# EAGLE schematic Schematics (EAGLE 9.1.0)
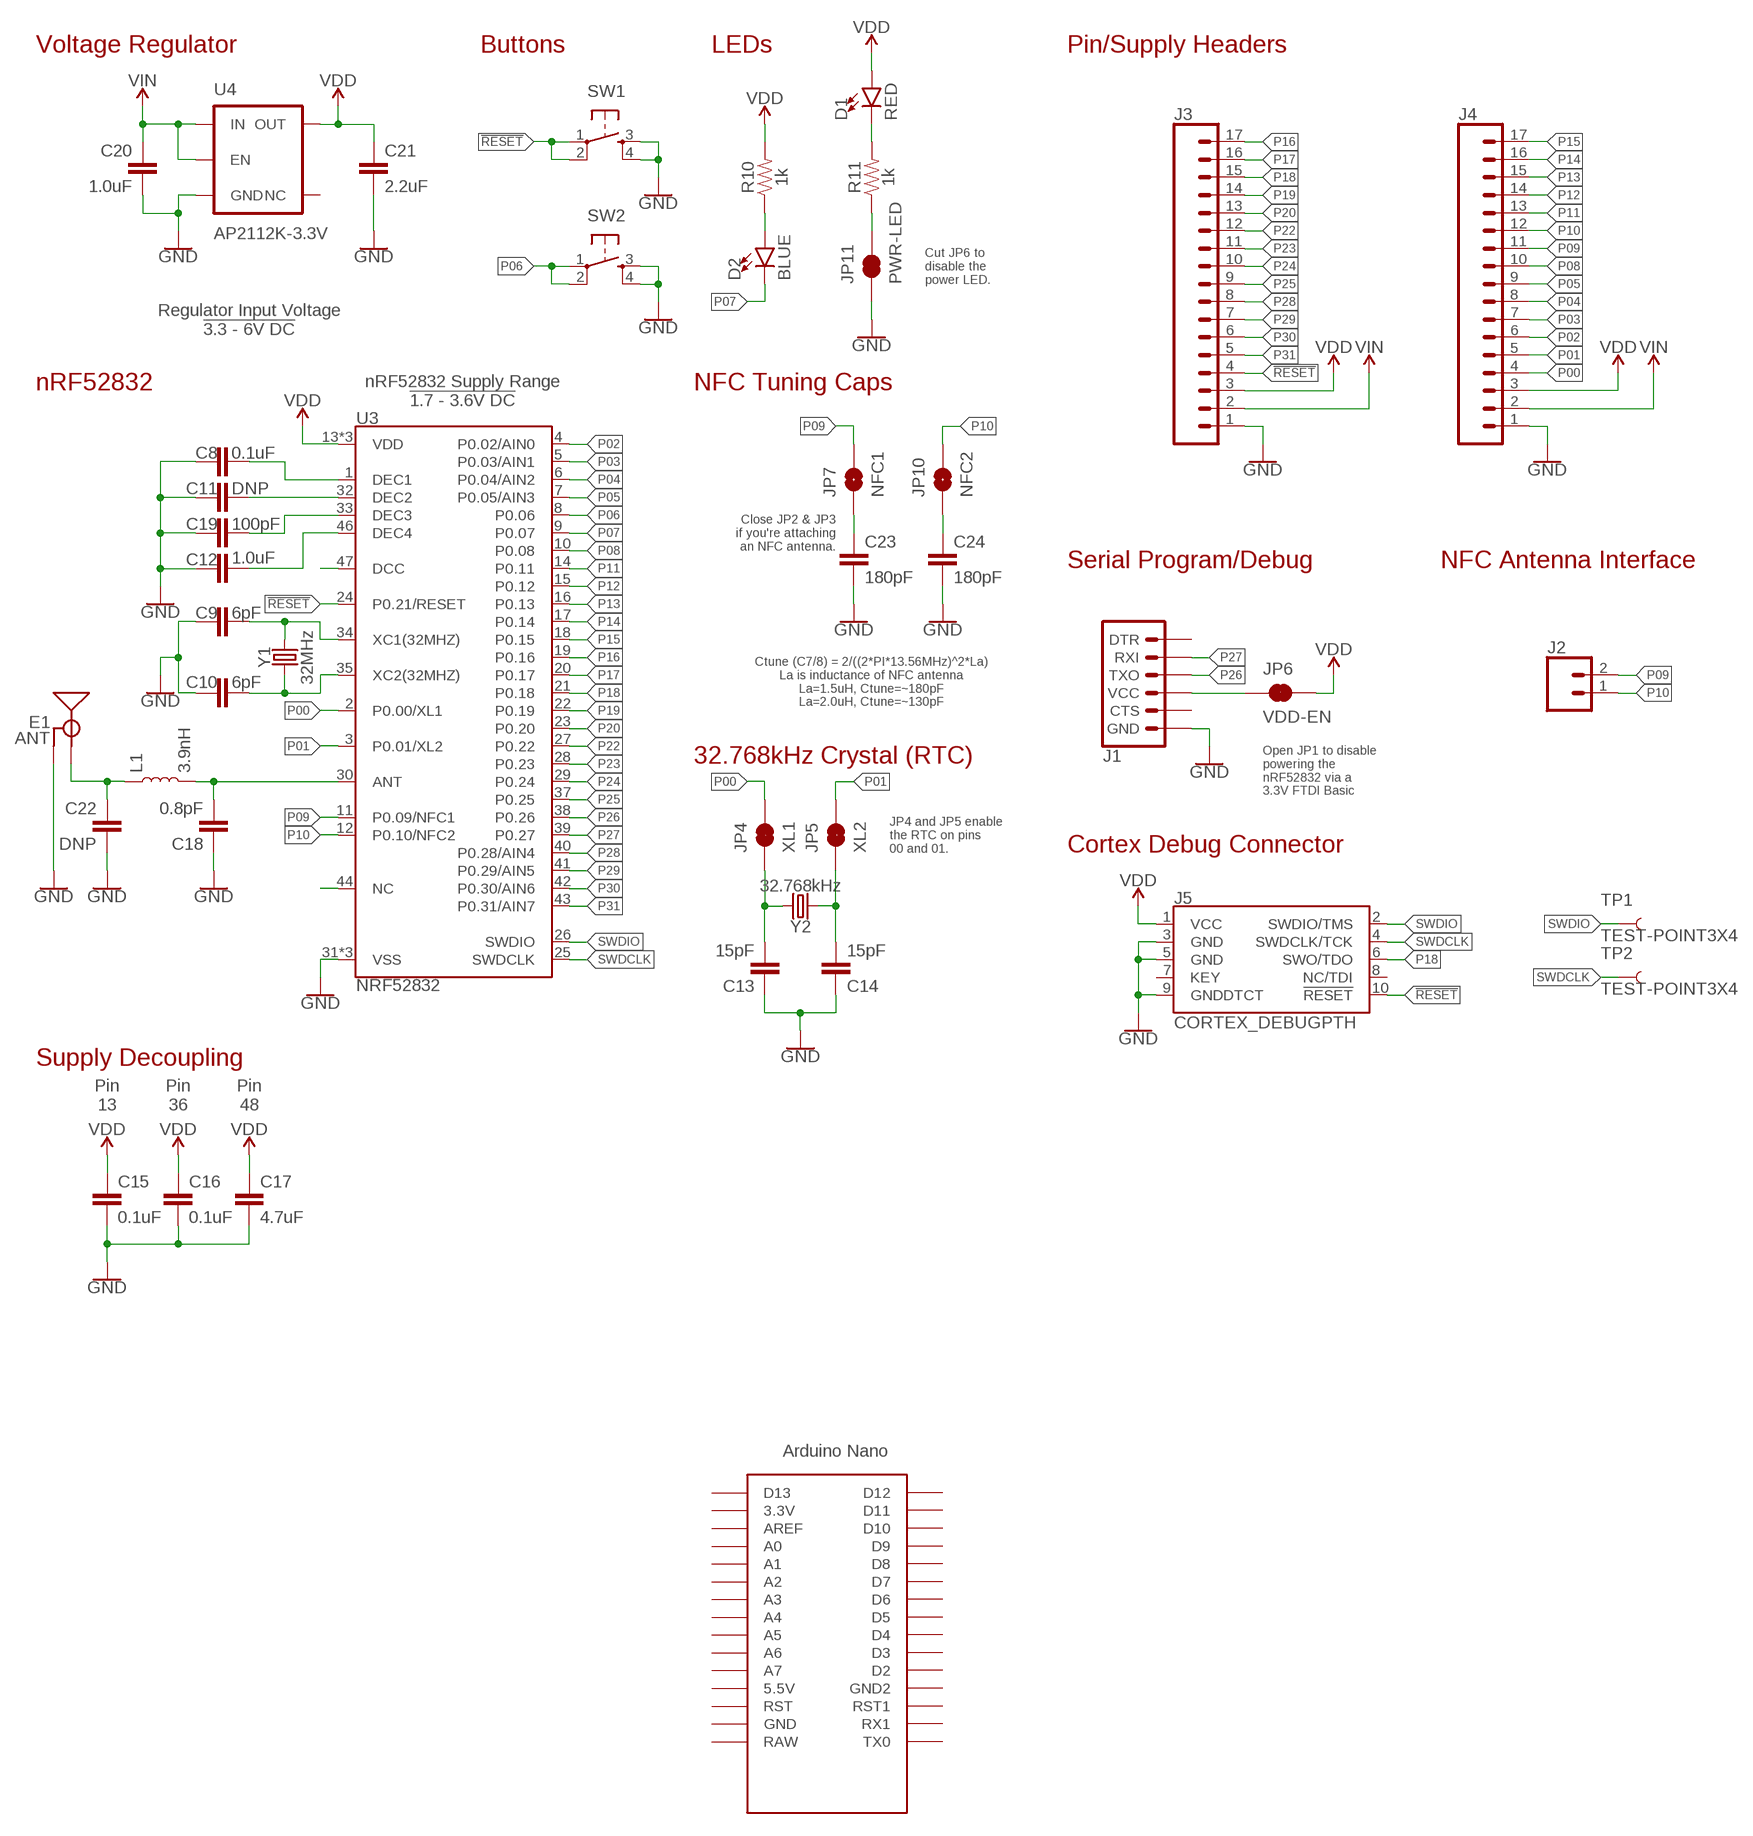
[diagram p0: schematic, sheet 1, part 1 of 2]
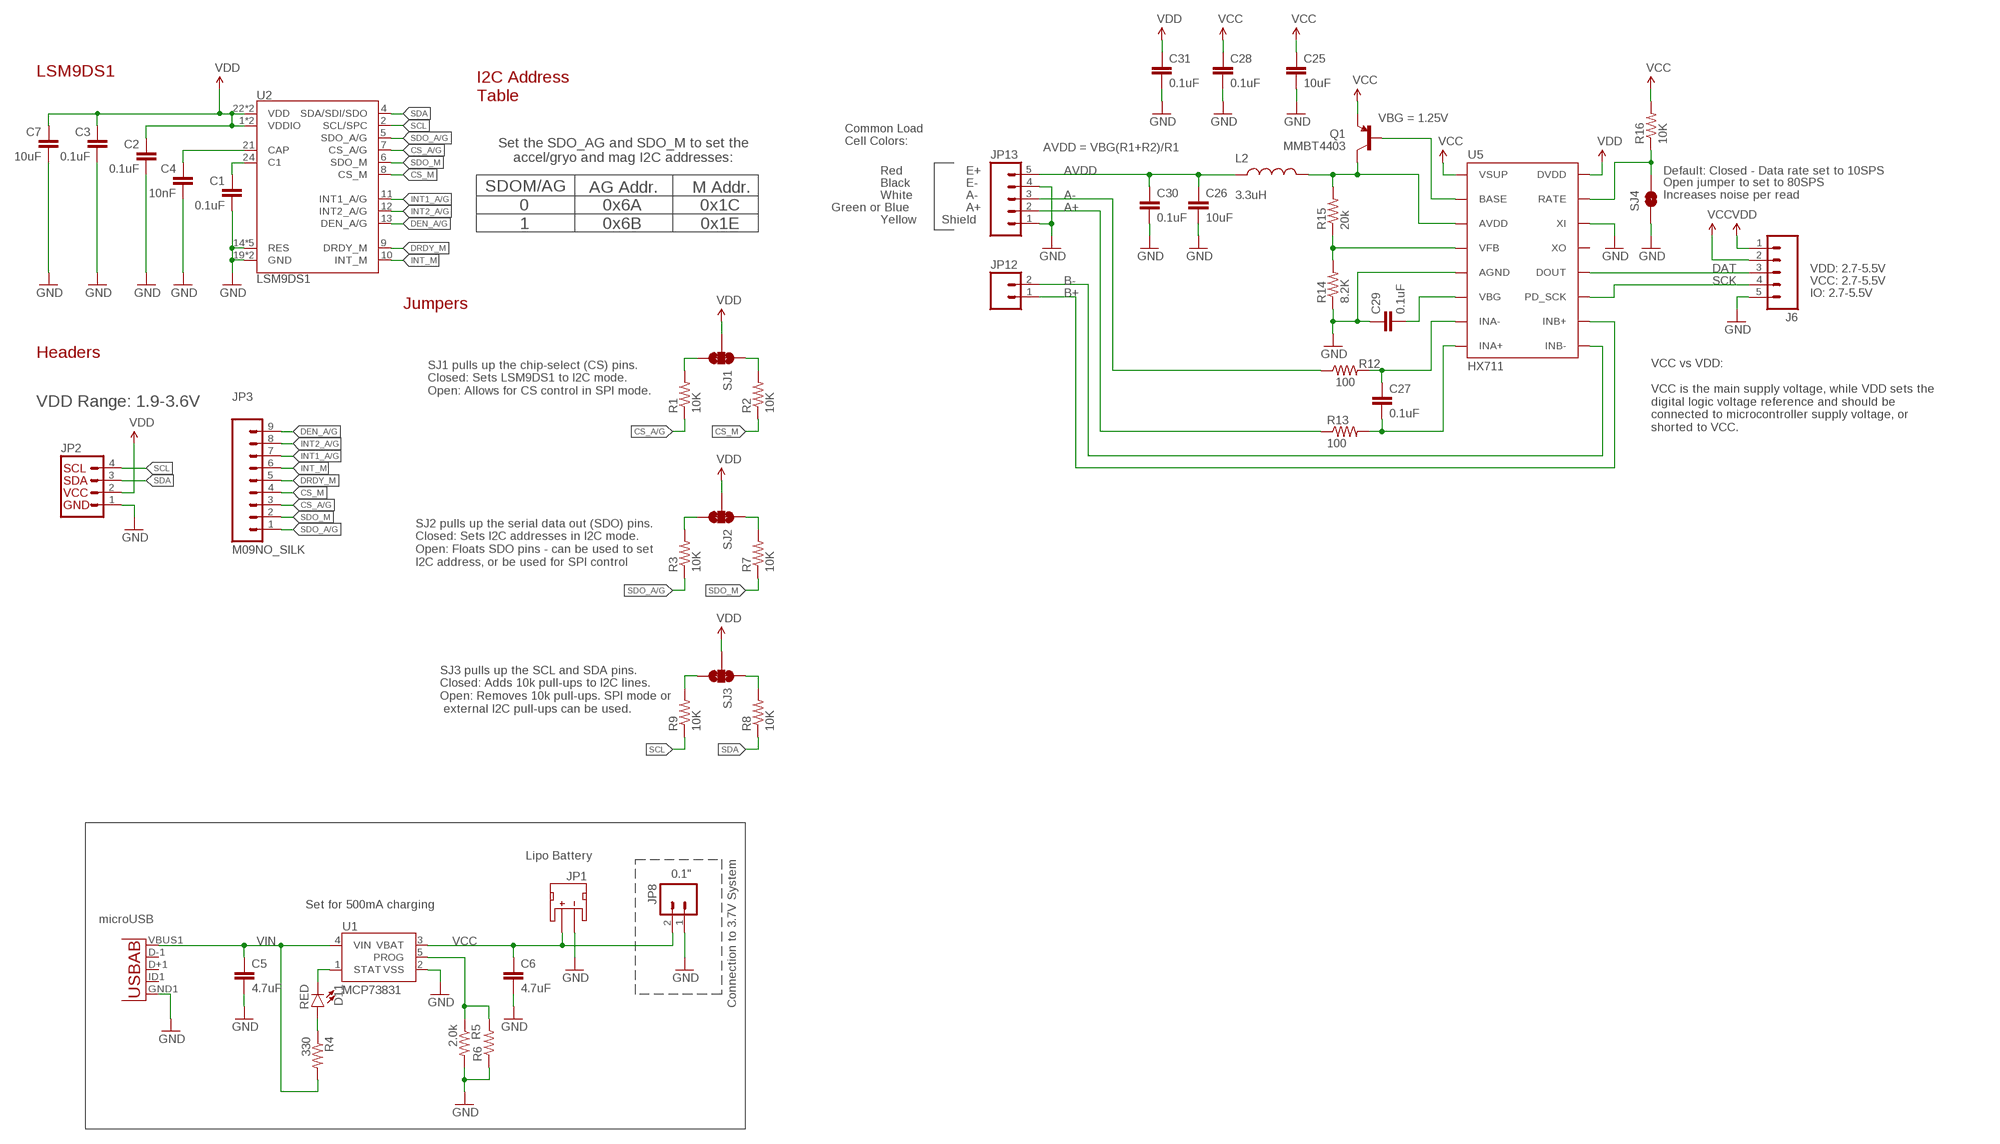
[diagram p1: schematic, sheet 1, part 2 of 2]

## Parts
C1  0.1uF  0.1UF-25V(+80/-20%)(0603)  [0603-CAP@1]
C2  0.1uF  0.1UF-25V(+80/-20%)(0603)  [0603-CAP@1]
C3  0.1uF  0.1UF-25V(+80/-20%)(0603)  [0603-CAP@1]
C4  10nF  10NF/10000PF-50V-10%(0603)  [0603-CAP@1]
C5  4.7uF  4.7UF-6.3V-10%(0603)0603  [0603-CAP@1]
C6  4.7uF  4.7UF-6.3V-10%(0603)0603  [0603-CAP@1]
C7  10uF  10UF-6.3V-20%(0603)  [0603-CAP@1]
C8  0.1uF  0.1UF-0402-16V-10%  [0402]
C9  6pF  6PF-0402-50V-0.5%  [0402]
C10  6pF  6PF-0402-50V-0.5%  [0402]
C11  DNP  CAP0402  [0402]
C12  1.0uF  1.0UF-0402-16V-10%  [0402]
C13  15pF  15PF-0402-50V-5%  [0402]
C14  15pF  15PF-0402-50V-5%  [0402]
C15  0.1uF  0.1UF-0402-16V-10%  [0402]
C16  0.1uF  0.1UF-0402-16V-10%  [0402]
C17  4.7uF  4.7UF0603  [0603]
C18  0.8pF  0.8PF-0402-50V-0.1PF  [0402]
C19  100pF  100PF-0402-50V-5%  [0402]
C20  1.0uF  1.0UF-0603-16V-10%  [0603]
C21  2.2uF  2.2UF-0603-10V-20%  [0603]
C22  DNP  CAP0402  [0402]
C23  180pF  180PF-0603-50V-5%  [0603]
C24  180pF  180PF-0603-50V-5%  [0603]
C25  10uF  10UF50V20%(1210)  [1210]
C26  10uF  10UF50V20%(1210)  [1210]
C27  0.1uF  0.1UF-25V-5%(0603)  [0603-CAP]
C28  0.1uF  0.1UF-25V-5%(0603)  [0603-CAP]
C29  0.1uF  0.1UF-25V-5%(0603)  [0603-CAP]
C30  0.1uF  0.1UF-25V-5%(0603)  [0603-CAP]
C31  0.1uF  0.1UF-25V-5%(0603)  [0603-CAP]
D1  RED  LED-RED0603  [LED-0603]
D2  BLUE  LED-BLUE0603  [LED-0603]
D11  RED  LED-RED0603  [LED-0603]
E1  ANT  ANTENNA-GROUNDEDTRACE-15.2MM  [TRACE_ANTENNA_2.4GHZ_15.2MM]
J1  ARDUINO_SERIAL_PROGRAMPTH  [1X06]
J2  CONN_02PTH  [1X02@2]
J3  CONN_17  [1X17]
J4  CONN_17  [1X17]
J5  CORTEX_DEBUGPTH  [2X5-PTH-1.27MM]
J6  M05PTH  [1X05]
JP1  JST  JST_2MM_MALE  [JST-2-SMD@1]
JP2  I2C_STANDARD_NO_SILK  [1X04_NO_SILK]
JP3  M09NO_SILK  [1X09_NO_SILK]
JP4  XL1  JUMPER-PAD-2-NC_BY_TRACE  [PAD-JUMPER-2-NC_BY_TRACE_YES_SILK]
JP5  XL2  JUMPER-PAD-2-NC_BY_TRACE  [PAD-JUMPER-2-NC_BY_TRACE_YES_SILK]
JP6  VDD-EN  JUMPER-SMT_2_NC_TRACE_SILK  [SMT-JUMPER_2_NC_TRACE_SILK]
JP7  NFC1  JUMPER-SMT_2_NO_SILK  [SMT-JUMPER_2_NO_SILK]
JP8  M02PTH  [1X02]
JP9  Micro USB  USB-ABCONN-11794  [USB-AB-MICRO-SMD_V03]
JP10  NFC2  JUMPER-SMT_2_NO_SILK  [SMT-JUMPER_2_NO_SILK]
JP11  PWR-LED  JUMPER-PAD-2-NC_BY_TRACE  [PAD-JUMPER-2-NC_BY_TRACE_YES_SILK]
JP12  M02PTH  [1X02]
JP13  M05PTH  [1X05]
L1  3.9nH  INDUCTOR-0402-3.9NH  [0402]
L2  3.3uH  INDUCTOR0805-IND  [0805]
Q1  MMBT4403  TRANSISTOR_PNPMMBT4403  [SOT23-3]
R1  10K  10KOHM-1/10W-1%(0603)0603  [0603-RES]
R2  10K  10KOHM-1/10W-1%(0603)0603  [0603-RES]
R3  10K  10KOHM-1/10W-1%(0603)0603  [0603-RES]
R4  330  330OHM1/10W1%(0603)  [0603-RES@1]
R5  2.0k  2.0KOHM1/10W5%(0603)  [0603-RES@1]
R6  RESISTORPTH-1/4W-VERT-KIT  [AXIAL-0.1EZ]
R7  10K  10KOHM-1/10W-1%(0603)0603  [0603-RES]
R8  10K  10KOHM-1/10W-1%(0603)0603  [0603-RES]
R9  10K  10KOHM-1/10W-1%(0603)0603  [0603-RES]
R10  1k  1KOHM-0603-1/10W-1%  [0603]
R11  1k  1KOHM-0603-1/10W-1%  [0603]
R12  100  100OHM-1/10W-1%(0603)  [0603-RES]
R13  100  100OHM-1/10W-1%(0603)  [0603-RES]
R14  8.2K  8.2KOHM-1/10W-5%(0603)  [0603-RES]
R15  20k  20KOHM1/10W1%(0603)  [0603-RES]
R16  10K  10KOHM-1/10W-1%(0603)0603  [0603-RES]
SJ1  JUMPER-PAD-3-NC_BY_TRACE  [PAD-JUMPER-3-3OF3_NC_BY_TRACE_YES_SILK_FULL_BOX]
SJ2  JUMPER-PAD-3-NC_BY_TRACE  [PAD-JUMPER-3-3OF3_NC_BY_TRACE_YES_SILK_FULL_BOX]
SJ3  JUMPER-PAD-3-NC_BY_TRACE  [PAD-JUMPER-3-3OF3_NC_BY_TRACE_YES_SILK_FULL_BOX]
SJ4  JUMPER-PAD-2-NC_BY_TRACE  [PAD-JUMPER-2-NC_BY_TRACE_YES_SILK]
SW1  SWITCH_SPST_4_PINRECT  [TACTILE_SWITCH_SMD_4.6X2.8MM]
SW2  SWITCH_SPST_4_PINRECT  [TACTILE_SWITCH_SMD_4.6X2.8MM]
TP1  TEST-POINT3X4  [PAD.03X.04]
TP2  TEST-POINT3X4  [PAD.03X.04]
U1  MCP73831  [SOT23-5@1]
U2  LSM9DS1  [LGA24-8X4]
U3  NRF52832  [QFN48-6X6MM]
U4  AP2112K-3.3V  V_REG_AP2112K-3.3V  [SOT23-5]
U5  HX711  HX711HX711  [SO16]
U$1  NANO  [NANO]
Y1  32MHz  CRYSTAL-32MHZ-SMD-2.0X1.6MM  [CRYSTAL-SMD-2.0X1.6MM]
Y2  32.768kHz  CRYSTAL-32.768KHZSMD-3.2X1.5  [CRYSTAL-SMD-3.2X1.5MM]

## Nets
!RESET!: J3.4 J5.10(!RESET) SW1.1 SW1.2 U3.24(P0.21/RESET)
A+: JP13.2 R13.1
A-: JP13.3 R12.1
ANT: C18.2 L1.2 U3.30(ANT)
AVDD: C26.1 C30.1 JP13.5 L2.1
B+: JP12.1 U5.10(INB+)
B-: JP12.2 U5.9(INB-)
C1: C1.1 U2.24(C1)
CAP: C4.1 U2.21(CAP)
CS_A/G: JP3.3 R1.1 U2.7(CS_A/G)
CS_A/G_PU: R1.2 SJ1.3
CS_M: JP3.4 R2.1 U2.8(CS_M)
CS_M_PU: R2.2 SJ1.1
DAT: J6.3 U5.12(DOUT)
DCC: U3.47(DCC)
DEC1: C8.2 U3.1(DEC1)
DEC2: C11.2 U3.32(DEC2)
DEC3: C19.2 U3.33(DEC3)
DEC4: C12.2 U3.46(DEC4)
DEN_A/G: JP3.9 U2.13(DEN_A/G)
DRDY_M: JP3.5 U2.9(DRDY_M)
GND: C1.2 C2.2 C3.2 C4.2 C5.2 C6.2 C7.2 C8.1 C9.1 C10.2 C11.1 C12.1 C13.1 C14.1 C15.2 C16.2 C17.2 C18.1 C19.1 C20.2 C21.2 C22.2 C23.2 C24.2 C25.2 C26.2 C28.2 C29.1 C30.2 C31.2 E1.GND J1.6(GND) J3.1 J4.1 J5.3(GND) J5.5(GND) J5.9(GNDDTCT) J6.5 JP1.1(-) JP2.1 JP8.1 JP9.GND1(GND) JP11.1 JP13.1 JP13.4 R5.2 R6.P$1 R14.1 SJ4.1 SW1.3 SW1.4 SW2.3 SW2.4 U1.2(VSS) U2.14(RES) U2.15(RES) U2.16(RES) U2.17(RES) U2.18(RES) U2.19(GND) U2.20(GND) U3.31(VSS) U3.45(VSS) U3.EP(VSS) U4.2(GND) U5.5(AGND) U5.14(XI)
INT1_A/G: JP3.7 U2.11(INT1_A/G)
INT2_A/G: JP3.8 U2.12(INT2_A/G)
INT_M: JP3.6 U2.10(INT_M)
N$1: JP11.2 R11.1
N$2: Q1.1(B) U5.2(BASE)
N$3: C13.2 JP4.1 Y2.P$2
N$4: C14.2 JP5.1 Y2.P$1
N$5: L2.2 Q1.3(C) R15.2 U5.3(AVDD)
N$6: R14.2 R15.1 U5.4(VFB)
N$7: C29.2 U5.6(VBG)
N$8: D11.A R4.1
N$9: R16.1 SJ4.2 U5.15(RATE)
N$10: C27.1 R12.2 U5.7(INA-)
N$11: C22.1 E1.ANT(SIGNAL) L1.1
N$12: D1.C R11.2
N$13: C27.2 R13.2 U5.8(INA+)
N$14: J1.4(VCC) JP6.1
N$15: D2.A R10.1
NC: U3.44(NC)
NFC1: C23.1 JP7.1
NFC2: C24.1 JP10.1
P00: J4.4 JP4.2 U3.2(P0.00/XL1)
P01: J4.5 JP5.2 U3.3(P0.01/XL2)
P02: J4.6 U3.4(P0.02/AIN0)
P03: J4.7 U3.5(P0.03/AIN1)
P04: J4.8 U3.6(P0.04/AIN2)
P05: J4.9 U3.7(P0.05/AIN3)
P06: SW2.1 SW2.2 U3.8(P0.06)
P07: D2.C U3.9(P0.07)
P08: J4.10 U3.10(P0.08)
P09: J2.2 J4.11 JP7.2 U3.11(P0.09/NFC1)
P10: J2.1 J4.12 JP10.2 U3.12(P0.10/NFC2)
P11: J4.13 U3.14(P0.11)
P12: J4.14 U3.15(P0.12)
P13: J4.15 U3.16(P0.13)
P14: J4.16 U3.17(P0.14)
P15: J4.17 U3.18(P0.15)
P16: J3.17 U3.19(P0.16)
P17: J3.16 U3.20(P0.17)
P18: J3.15 J5.6(SWO/TDO) U3.21(P0.18)
P19: J3.14 U3.22(P0.19)
P20: J3.13 U3.23(P0.20)
P22: J3.12 U3.27(P0.22)
P23: J3.11 U3.28(P0.23)
P24: J3.10 U3.29(P0.24)
P25: J3.9 U3.37(P0.25)
P26: J1.3(TXO) U3.38(P0.26)
P27: J1.2(RXI) U3.39(P0.27)
P28: J3.8 U3.40(P0.28/AIN4)
P29: J3.7 U3.41(P0.29/AIN5)
P30: J3.6 U3.42(P0.30/AIN6)
P31: J3.5 U3.43(P0.31/AIN7)
PROG: R5.1 R6.P$2 U1.5(PROG)
SCK: J6.4 U5.11(PD_SCK)
SCL: JP2.4 R9.1 U2.2(SCL/SPC)
SCL_PU: R9.2 SJ3.3
SDA: JP2.3 R8.1 U2.4(SDA/SDI/SDO)
SDA_PU: R8.2 SJ3.1
SDO_A/G: JP3.1 R3.1 U2.5(SDO_A/G)
SDO_A/G_PU: R3.2 SJ2.3
SDO_M: JP3.2 R7.1 U2.6(SDO_M)
SDO_M_PU: R7.2 SJ2.1
STAT: D11.C U1.1(STAT)
SWDCLK: J5.4(SWDCLK/TCK) TP2.P$1 U3.25(SWDCLK)
SWDIO: J5.2(SWDIO/TMS) TP1.P$1 U3.26(SWDIO)
VCC: C6.1 C25.1 C28.1 J6.2 JP1.2(+) JP8.2 Q1.2(E) R16.2 U1.3(VBAT) U5.1(VSUP)
VDD: C2.1 C3.1 C7.1 C15.1 C16.1 C17.1 C21.1 C31.1 D1.A J3.3 J4.3 J5.1(VCC) J6.1 JP2.2 JP6.2 R10.2 SJ1.2 SJ2.2 SJ3.2 U2.1(VDDIO) U2.3(VDDIO) U2.22(VDD) U2.23(VDD) U3.13(VDD) U3.36(VDD) U3.48(VDD) U4.5(OUT) U5.16(DVDD)
VIN: C5.1 C20.1 J3.2 J4.2 JP9.VBUS1(VBUS) R4.2 U1.4(VIN) U4.1(IN) U4.3(EN)
XC1: C9.2 U3.34(XC1(32MHZ)) Y1.3
XC2: C10.1 U3.35(XC2(32MHZ)) Y1.1
Unconnected: J1.1(DTR) J1.5(CTS) J5.7(KEY) J5.8(NC/TDI) JP1.NC1(PAD1) JP1.NC2(PAD2) JP9.D+1(D+) JP9.D-1(D-) JP9.ID1(USBID) U4.4(NC) U5.13(XO) U$1.3.3V U$1.5V(5.5V) U$1.A0 U$1.A1 U$1.A2 U$1.A3 U$1.A4 U$1.A5 U$1.A6 U$1.A7 U$1.AREF U$1.D2 U$1.D3 U$1.D4 U$1.D5 U$1.D6 U$1.D7 U$1.D8 U$1.D9 U$1.D10 U$1.D11 U$1.D12 U$1.D13 U$1.GND U$1.GND1(GND2) U$1.ICSP1 U$1.ICSP2 U$1.ICSP3 U$1.ICSP4 U$1.ICSP5 U$1.ICSP6 U$1.RAW U$1.RST U$1.RST1 U$1.RX1 U$1.TX0

## Notes on the sheet
- Voltage Regulator | Buttons | LEDs | Pin/Supply Headers
- LSM9DS1
- I2C Address
  Table
- VBG = 1.25V
- Common Load
  Cell Colors:
- Set the SDO_AG and SDO_M to set the
  accel/gryo and mag I2C addresses:
- AVDD = VBG(R1+R2)/R1
- Red | E+ | Default: Closed - Data rate set to 10SPS
- SDOM/AG | AG Addr. | M Addr. | Black | E-
- Cut JP6 to
  disable the
  power LED.
- White | A-
- Open jumper to set to 80SPS
  Increases noise per read
- Green or Blue | A+
- 0
  1
- 0x6A
  0x6B
- 0x1C
  0x1E
- Yellow | Shield
- Regulator Input Voltage
  !3.3 - 6V DC!
- VDD: 2.7-5.5V
- VCC: 2.7-5.5V
- nRF52832
- nRF52832 Supply Range
  !1.7 - 3.6V DC!
- NFC Tuning Caps | IO: 2.7-5.5V
- Jumpers
- Headers
- Close JP2 & JP3
  if you're attaching
  an NFC antenna.
- SJ1 pulls up the chip-select (CS) pins.
  Closed: Sets LSM9DS1 to I2C mode.
  Open: Allows for CS control in SPI mode.
- VDD Range: 1.9-3.6V
- Serial Program/Debug | NFC Antenna Interface
- VCC vs VDD:
  
  VCC is the main supply voltage, while VDD sets the
  digital logic voltage reference and should be
  connected to microcontroller supply voltage, or
  shorted to VCC.
- Ctune (C7/8) = 2/((2*PI*13.56MHz)^2*La)
  La is inductance of NFC antenna
  La=1.5uH, Ctune=~180pF
  La=2.0uH, Ctune=~130pF
- Open JP1 to disable 
  powering the 
  nRF52832 via a
  3.3V FTDI Basic
- 32.768kHz Crystal (RTC)
- SJ2 pulls up the serial data out (SDO) pins.
  Closed: Sets I2C addresses in I2C mode.
  Open: Floats SDO pins - can be used to set
  I2C address, or be used for SPI control
- JP4 and JP5 enable
  the RTC on pins
  00 and 01.
- Cortex Debug Connector
- SJ3 pulls up the SCL and SDA pins.
  Closed: Adds 10k pull-ups to I2C lines.
  Open: Removes 10k pull-ups. SPI mode or
   external I2C pull-ups can be used.
- Supply Decoupling
- Pin
  13
- Pin
  36
- Pin
  48
- Lipo Battery
- 0.1"
- Set for 500mA charging
- microUSB
- Connection to 3.7V System

## Library data of the parts
C1-C3 = SparkFun-Capacitors:0.1UF-25V(+80/-20%)(0603): CAP-00810 Ceramic Standard decoupling cap; PROD_ID: CAP-00810
C4 = SparkFun-Capacitors:10NF/10000PF-50V-10%(0603): CAP-00867; PROD_ID: CAP-00867
C5 C6 = SparkFun-Capacitors:4.7UF-6.3V-10%(0603): CAP-08280; PROD_ID: CAP-08280
C7 = SparkFun-Capacitors:10UF-6.3V-20%(0603): CAP-11015; PROD_ID: CAP-11015
C8 C15 C16 = SparkFun-Capacitors:0.1UF: 0.1µF ceramic capacitors A capacitor is a passive two-terminal electrical component used to store electrical energy temporarily in an electric field.; PROD_ID: CAP-12416
C9 C10 = nrf52832-breakout-temp:6PF: 15pF ceramic capacitors A capacitor is a passive two-terminal electrical component used to store electrical energy temporarily in an electric field.; PROD_ID: CAP-13455
C11 C22 = SparkFun-Passives:CAP: Capacitor Standard 0603 ceramic capacitor, and 0.1" leaded capacitor.
C12 = SparkFun-Capacitors:1.0UF: 1µF ceramic capacitors A capacitor is a passive two-terminal electrical component used to store electrical energy temporarily in an electric field.; PROD_ID: CAP-12417
C13 C14 = SparkFun-Capacitors:15PF: 15pF ceramic capacitors A capacitor is a passive two-terminal electrical component used to store electrical energy temporarily in an electric field.; PROD_ID: CAP-13063
C17 = SparkFun-Capacitors:4.7UF: 4.7µF ceramic capacitors A capacitor is a passive two-terminal electrical component used to store electrical energy temporarily in an electric field.; PROD_ID: CAP-08280
C18 = nrf52832-breakout-temp:0.8PF: 0.8pF ceramic capacitors A capacitor is a passive two-terminal electrical component used to store electrical energy temporarily in an electric field.; PROD_ID: CAP-13456
C19 = nrf52832-breakout-temp:100PF: 100pF/0.1nF ceramic capacitors A capacitor is a passive two-terminal electrical component used to store electrical energy temporarily in an electric field.; PROD_ID: CAP-13458
C20 = SparkFun-Capacitors:1.0UF: 1µF ceramic capacitors A capacitor is a passive two-terminal electrical component used to store electrical energy temporarily in an electric field.; PROD_ID: CAP-00868
C21 = SparkFun-Capacitors:2.2UF: 2.2µF ceramic capacitors A capacitor is a passive two-terminal electrical component used to store electrical energy temporarily in an electric field.; PROD_ID: CAP-07888
C23 C24 = nrf52832-breakout-temp:180PF: 180pF/0.18nF ceramic capacitors A capacitor is a passive two-terminal electrical component used to store electrical energy temporarily in an electric field.; PROD_ID: CAP-11661
C25 C26 = SparkFun-Capacitors:10UF50V20%(1210): CAP-09824; PROD_ID: CAP-09824
C27-C31 = SparkFun-Capacitors:0.1UF-25V-5%(0603): CAP-08604; PROD_ID: CAP-08604
D1 D11 = SparkFun-LED:LED-RED: Red SMD LED Used in manufacturing of most products at SparkFun Packages: 0603 - SMD 0603 package [Product Link] <http://docs.avagotech.com/docs/AV02-0551EN> 0603 SMART - SMD 0603 SMART package ( more efficient and expensive)[Product Link] <http://www.osram-os.com/Graphics/XPic2/00077099_0.pdf> 1206 - SMD1206 package [Product Link] <https://www.sparkfun.com/datasheets/DevTools/LilyPad/Q150OVS4.pdff> SparkFun Products: Pro Mini 328 -5V <https://www.sparkfun.com/products/821> RedBoard <https://www.sparkfun.com/products/12757> IOIO-OTG <https://www.sparkfun.com/products/13613>; PROD_ID: DIO-00819
D2 = SparkFun-LED:LED-BLUE: Blue SMD LED Used in manufacturing of various products at SparkFun Packages: 0603 - SMD 0603 package [Product Link] <http://www.digikey.com/product-detail/en/SMLE12BC7TT86/511-1589-2-ND/1641808> 1206 - SMD1206 package [Product Link] <http://www.digikey.com/product-detail/en/lite-on-inc/LTST-C150TBKT/160-1643-1-ND/573584> SparkFun Products: ESP8266 Thing-Dev Board <https://www.sparkfun.com/products/13711> RedBoard <https://www.sparkfun.com/products/12757>; PROD_ID: DIO-08575
E1 = SparkFun-RF:ANTENNA-GROUNDED: Antenna w/ Ground Connection 2.4GHz antennae with signal and ground terminals. TRACE_ANTENNA_2.4GHZ_15.2MM - Meander Trace antenna 15.2 x 5.7mm footprint Based on layout from TI app note AN043 <http://www.ti.com/lit/an/swra117d/swra117d.pdf>. TRACE_ANTENNA_2.4GHZ_25.7MM - Inverted F trace antenna 25.7 x 7.5 mm footprint. Based on layout from TI design note DN0007 <http://www.ti.com/lit/an/swru120b/swru120b.pdf>.
J1 = SparkFun-Connectors:ARDUINO_SERIAL_PROGRAM: FTDI connector footprints
J2 = SparkFun-Connectors:CONN_02: Multi connection point. Often used as Generic Header-pin footprint for 0.1 inch spaced/style header connections On any of the 0.1 inch spaced packages, you can populate with these: Break Away Headers - Straight <https://www.sparkfun.com/products/116> (PRT-00116) Break Away Male Headers - Right Angle <https://www.sparkfun.com/products/553> (PRT-00553) Female Headers <https://www.sparkfun.com/products/115> (PRT-00115) Break Away Headers - Machine Pin <https://www.sparkfun.com/products/117> (PRT-00117) Break Away Female Headers - Swiss Machine Pin <https://www.sparkfun.com/products/743> (PRT-00743) For SCREWTERMINALS and SPRING TERMINALS visit here: Screw Terimnals on SparkFun.com <https://www.sparkfun.com/search/results?term=Screw+Terminals> (5mm/3.5mm/2.54mm spacing) This device is also useful as a general connection point to wire up your design to another part of your project. Our various solder wires solder well into these plated through hole pads. Hook-Up Wire - Assortment (Stranded, 22 AWG) <https://www.sparkfun.com/products/11375> (PRT-11375) Hook-Up Wire - Assortment (Solid Core, 22 AWG) <https://www.sparkfun.com/products/11367> (PRT-11367) View the entire wire category on our website here <https://www.sparkfun.com/categories/141> Special notes: Molex polarized connector foot print use with: PRT-08233 with associated crimp pins and housings. 2.54_SCREWTERM for use with PRT-10571. 3.5mm Screw Terminal footprints for PRT-08084 5mm Screw Terminal footprints for use with PRT-08432
J3 J4 = SparkFun-Connectors:CONN_17: 1x17 .1" header
J5 = SparkFun-Connectors:CORTEX_DEBUG: Cortex Debug Connector Datasheet <http://infocenter.arm.com/help/topic/com.arm.doc.faqs/attached/13634/cortex_debug_connectors.pdf>
J6 JP13 = SparkFun-Connectors:M05: Header 5 Standard 5-pin 0.1" header. Use with straight break away headers (SKU : PRT-00116), right angle break away headers (PRT-00553), swiss pins (PRT-00743), machine pins (PRT-00117), and female headers (PRT-00115). Molex polarized connector foot print use with SKU : PRT-08230 with associated crimp pins and housings.
JP1 = SparkFun-Connectors:JST_2MM_MALE: Mates to single-cell LiPo batteries. CONN-08352; PROD_ID: CONN-08352
JP2 = SparkFun-Connectors:I2C_STANDARD: SparkFun has standardized on a pinout for all I2C based sensor breakouts. This pinout allows I2C boards to be plugged directly into the headers on Arduino Uno compatible boards, and to be daisy chained easily.
JP3 = SparkFun-Connectors:M09: Header 9 Standard 9-pin 0.1" header. Use with straight break away headers (SKU : PRT-00116), right angle break away headers (PRT-00553), swiss pins (PRT-00743), machine pins (PRT-00117), and female headers (PRT-00115).
JP4 JP5 JP11 = SparkFun-Jumpers:JUMPER-PAD-2-NC_BY_TRACE
JP6 = SparkFun-Jumpers:JUMPER-SMT_2_NC_TRACE: Normally closed trace jumper This jumper has a trace between two pads so it's normally closed (NC). Use a razor knife to open the connection. For best results follow the IPC guidelines for cutting traces: Cutout at least 0.063 mm (0.005 in). Remove all loose material to clean up the cut area. Seal the cut with an approved epoxy. Reapply solder to reclose the connection.
JP7 JP10 = SparkFun-Jumpers:JUMPER-SMT_2_NO: Normally open jumper This jumper has two pads in close proximity to each other. Apply solder to close the connection. Round pads are easier to solder for beginners, but are a lot larger. SparkFun Product that uses the round pads: SparkFun EL Sequencer <https://www.sparkfun.com/products/12781>
JP8 JP12 = SparkFun-Connectors:M02: Standard 2-pin 0.1" header. Use with - straight break away headers ( PRT-00116) - right angle break away headers (PRT-00553) - swiss pins (PRT-00743) - machine pins (PRT-00117) - female headers (PRT-00115) Molex polarized connector foot print use with: PRT-08233 with associated crimp pins and housings. 2.54_SCREWTERM for use with PRT-10571. 3.5mm Screw Terminal footprints for PRT-08084 5mm Screw Terminal footprints for use with PRT-08432
JP9 = SparkFun-Connectors:USB-AB: This is a USB AB connector that is compatible with USB OTG. i.e. this connector can serve as a host or device; PROD_ID: CONN-11794
L1 = nrf52832-breakout-temp:INDUCTOR: Inductors; PROD_ID: NDUC-13457
L2 = SparkFun-Passives:INDUCTOR: Inductors; PROD_ID: NDUC-13076
Q1 = SparkFun-DiscreteSemi:TRANSISTOR_PNP: Generic PNP BJT Double check pinouts against datasheets- not all devices are the same! MMBT3906 - 40V 200mA SOT-23 (TRANS-08052) MMBT4403 - 40V 600mA SOT-23 (TRANS-09245); PROD_ID: TRANS-09245
R1-R3 R7-R9 R16 = SparkFun-Resistors:10KOHM-1/10W-1%(0603): RES-00824; PROD_ID: RES-00824
R4 = SparkFun-Resistors:330OHM1/10W1%(0603): RES-00818; PROD_ID: RES-00818
R5 = SparkFun-Resistors:2.0KOHM1/10W5%(0603): RES-08296; PROD_ID: RES-08296
R6 = SparkFun-Resistors:RESISTOR: Resistor Basic schematic elements and footprints for 0603, 1206, and PTH resistors.
R10 R11 = SparkFun-Resistors:1KOHM: 1kΩ resistor A resistor is a passive two-terminal electrical component that implements electrical resistance as a circuit element. Resistors act to reduce current flow, and, at the same time, act to lower voltage levels within circuits.; PROD_ID: RES-07856
R12 R13 = SparkFun-Resistors:100OHM-1/10W-1%(0603): RES-07863; PROD_ID: RES-07863
R14 = SparkFun-Resistors:8.2KOHM-1/10W-5%(0603): RES-10646; PROD_ID: RES-10646
R15 = SparkFun-Resistors:20KOHM1/10W1%(0603): RES-09383; PROD_ID: RES-09383
SJ1-SJ3 = SparkFun-Passives:JUMPER-PAD-3-NC_BY_TRACE
SJ4 = SparkFun-Passives:JUMPER-PAD-2-NC_BY_TRACE
SW1 SW2 = SparkFun-Electromechanical:SWITCH_SPST_4_PIN; PROD_ID: SWCH-13065
TP1 TP2 = SparkFun-Connectors:TEST-POINT: Bare copper test points for troubleshooting or ICT
U1 = SparkFun-PowerIC:MCP73831: Miniature single cell, fully integrated Li-Ion, Li-polymer charge management controller http://ww1.microchip.com/downloads/en/DeviceDoc/21984a.pdf IC-09995; PROD_ID: IC-09995
U2 = LSM9DS1_temp:LSM9DS1: LSM9DS1 3D accelerometer, gyroscope & magnetometer The LSM9DS1 is a system-in-package featuring a 3D digital linear acceleration sensor, a 3D digital angular rate sensor, and a 3D digital magnetic sensor. The LSM9DS1 has a linear acceleration full scale of ±2g/±4g/±8/±16 g, a magnetic field full scale of ±4/±8/±12/±16 gauss and an angular rate of ±245/±500/±2000 dps. The LSM9DS1 includes an I2 C serial bus interface supporting standard and fast mode (100 kHz and 400 kHz) and an SPI serial standard interface. Magnetic, accelerometer and gyroscope sensing can be enabled or set in power-down mode separately for smart power management. The LSM9DS1 is available in a plastic land grid array package (LGA) and it is guaranteed to operate over an extended temperature range from -40 °C to +85 °C.; PROD_ID: IC-12536
U3 = nrf52832-breakout-temp:NRF52832: Nordic nRF52832 Bluetooth Smart/ANT/2.4GHz RF SoC The nRF52832 SoC is a powerful, highly flexible ultra-low power multiprotocol SoC ideally suited for Bluetooth® Smart ANT and 2.4GHz ultra low-power wireless applications. The nRF52832 SoC is built around a 32-bit ARM® Cortex™-M4F CPU with 512kB + 64kB RAM. The embedded 2.4GHz transceiver supports Bluetooth Smart, ANT and proprietary 2.4 GHz protocol stack. It is on air compatible with the nRF51 Series, nRF24L and nRF24AP Series products from Nordic Semiconductor. Product Page <https://www.nordicsemi.com/eng/Products/Bluetooth-low-energy2/nRF52832>; PROD_ID: IC-13460
U4 = SparkFun-PowerIC:V_REG_AP2112: AP2112 - 600mA CMOS LDO Regulator w/ Enable The AP2112 is CMOS process low dropout linear regulator with enable function, the regulator delivers a guaranteed 600mA (min.) continuous load current. Features Output Voltage Accuracy: ±1.5% Output Current: 600mA (Min.) Foldback Short Current Protection: 50mA Enable Function to Turn ON/OFF VOUT Low Dropout Voltage (3.3V): 250mV (Typ.) @IOUT=600mA Excellent Load Regulation: 0.2%/A (Typ.) Excellent Line Regulation: 0.02%/V (Typ.) Low Quiescent Current: 55μA (Typ.) Low Standby Current: 0.01μA (Typ.) Low Output Noise: 50μVRMS PSRR: 100Hz -65dB, 1kHz -65dB OTSD Protection Stable with 1.0μF Flexible Cap: Ceramic, Tantalum and Aluminum Electrolytic Operation Temperature Range: -40°C to 85°C ESD: MM 400V, HBM 4000V; PROD_ID: VREG-12457; VALUE: 3.3V
U5 = Testing:HX711; PROD_ID: IC-12445
U$1 = Arduino-clone:NANO: Arduino Nano
Y1 = nrf52832-breakout-temp:CRYSTAL-32MHZ: 32MHz Crystal Digikey Example <http://www.digikey.com/product-detail/en/murata-electronics-north-america/XRCGB32M000F2P00R0/490-9769-1-ND/4952013> Frequency: 32MHz Frequency Stability: ±20ppm Frequency Tolerance: ±20ppm Load Capacitance: 6pF; PROD_ID: XTAL-13459
Y2 = SparkFun-Clocks:CRYSTAL-32.768KHZ: 32.768kHz Crystal Frequency: 32.768kHz Frequency Stability: ±20ppm Load Capacitance: 12.5pF (PTH-2X6 & SMD-3.2X1.5), 6pF (SMD-2X6); PROD_ID: XTAL-13062